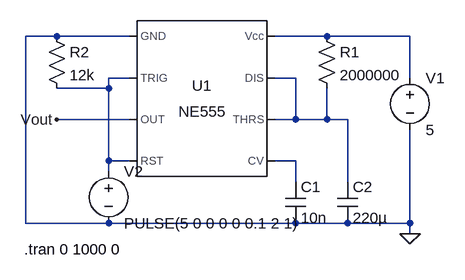
[diagram p0: schematic NE555.asc]
NE555.asc, the LTspice schematic file:
Version 4
SHEET 1 880 680
WIRE -32 64 -80 64
WIRE 80 64 -32 64
WIRE 384 64 304 64
WIRE 512 64 384 64
WIRE 80 128 48 128
WIRE 336 128 304 128
WIRE 512 128 512 64
WIRE 48 144 48 128
WIRE 48 144 -32 144
WIRE 80 192 -32 192
WIRE 336 192 336 128
WIRE 336 192 304 192
WIRE 384 192 384 144
WIRE 384 192 336 192
WIRE 416 192 384 192
WIRE 48 256 48 144
WIRE 80 256 48 256
WIRE 336 256 304 256
WIRE 48 272 48 256
WIRE 336 288 336 256
WIRE 416 288 416 192
WIRE -80 352 -80 64
WIRE 48 352 -80 352
WIRE 336 352 48 352
WIRE 416 352 336 352
WIRE 512 352 512 208
WIRE 512 352 416 352
WIRE 512 368 512 352
FLAG 512 368 0
FLAG -32 192 Vout
SYMBOL Misc\\NE555 192 160 R0
SYMATTR InstName U1
SYMBOL voltage 512 112 R0
SYMATTR InstName V1
SYMATTR Value 5
SYMBOL cap 320 288 R0
SYMATTR InstName C1
SYMATTR Value 10n
SYMBOL cap 400 288 R0
SYMATTR InstName C2
SYMATTR Value 220µ
SYMBOL res 368 48 R0
SYMATTR InstName R1
SYMATTR Value 2000000
SYMBOL res -48 48 R0
SYMATTR InstName R2
SYMATTR Value 12k
SYMBOL voltage 48 256 R0
WINDOW 123 0 0 Left 2
WINDOW 39 0 0 Left 2
SYMATTR InstName V2
SYMATTR Value PULSE(5 0 0 0 0 0.1 2 1)
TEXT -82 392 Left 2 !.tran 0 1000 0

The netlist it stands for:
* NE555.asc
XU1 0 N002 Vout N002 N004 N003 N003 N001 NE555  ; pins GND TRIG OUT RST CV THRS DIS Vcc
V1 N001 0 5
C1 N004 0 10n
C2 N003 0 220µ
R1 N001 N003 2000000
R2 0 N002 12k
V2 N002 0 PULSE(5 0 0 0 0 0.1 2 1)
.tran 0 1000 0
.lib NE555.sub
.backanno
.end